# Altium schematic sheet WIFI.SchDoc
size A
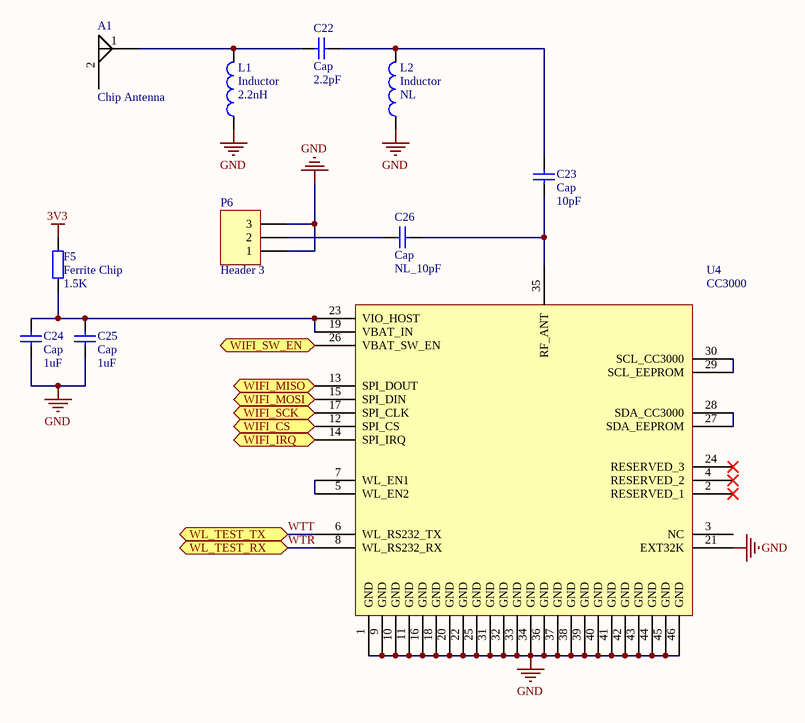
[diagram p0: WIFI.SchDoc]

## Parts
A1  Chip Antenna  [2500AT44M0400]
C22  Cap  value 2.2pF  [0402]
C23  Cap  value 10pF  [0402]
C24  Cap  value 1uF  [0603]
C25  Cap  value 1uF  [0603]
C26  Cap  value NL_10pF  [0402]
F5  Ferrite Chip  value 1.5K  [0603]
L1  Inductor  value 2.2nH  [0402]
L2  Inductor  value NL  [0402]
P6  Header 3  [U.FL-R-SMT-1]
U4  CC3000  [CC3000]

## Ports
WIFI_CS, WIFI_IRQ, WIFI_MISO, WIFI_MOSI, WIFI_SCK, WIFI_SW_EN, WL_TEST_RX, WL_TEST_TX

## Nets
3V3: F5.2
GND: C24.1 C25.1 L1.1 L2.1 P6.1 P6.3 U4.1(GND) U4.9(GND) U4.10(GND) U4.11(GND) U4.16(GND) U4.18(GND) U4.20(GND) U4.21(EXT32K) U4.22(GND) U4.25(GND) U4.31(GND) U4.32(GND) U4.33(GND) U4.34(GND) U4.36(GND) U4.37(GND) U4.38(GND) U4.39(GND) U4.40(GND) U4.41(GND) U4.42(GND) U4.43(GND) U4.44(GND) U4.45(GND) U4.46(GND)
WIFI_CS: U4.12(SPI_CS) ; port WIFI_CS
WIFI_IRQ: U4.14(SPI_IRQ) ; port WIFI_IRQ
WIFI_MISO: U4.13(SPI_DOUT) ; port WIFI_MISO
WIFI_MOSI: U4.15(SPI_DIN) ; port WIFI_MOSI
WIFI_SCK: U4.17(SPI_CLK) ; port WIFI_SCK
WIFI_SW_EN: U4.26(VBAT_SW_EN) ; port WIFI_SW_EN
WTR: U4.8(WL_RS232_RX) ; port WL_TEST_RX
WTT: U4.6(WL_RS232_TX) ; port WL_TEST_TX
NetA1_1: A1.1 C22.2 L1.2
NetC22_1: C22.1 C23.2 L2.2
NetC23_1: C23.1 C26.1 U4.35(RF_ANT)
NetC24_2: C24.2 C25.2 F5.1 U4.19(VBAT_IN) U4.23(VIO_HOST)
NetC26_2: C26.2 P6.2
NetU4_5: U4.5(WL_EN2) U4.7(WL_EN1)
NetU4_27: U4.27(SDA_EEPROM) U4.28(SDA_CC3000)
NetU4_29: U4.29(SCL_EEPROM) U4.30(SCL_CC3000)

Not connected (* = marked no-connect by the designer): A1 2; U4 2(RESERVED_1)* 3(NC) 4(RESERVED_2)* 24(RESERVED_3)*

## Library data of the parts
A1 = ANT-SMT-2: Supplier 1: Digi-Key; Supplier Part Number 1: 712-1403-1-ND
C22-C26 = Cap: Capacitor; Supplier 1: Digi-Key
  C22: Supplier Part Number 1: 490-5932-1-ND
  C23 C26: Supplier Part Number 1: 311-1014-1-ND
  C24 C25: Supplier Part Number 1: 587-1242-1-ND
F5 = Res2: Supplier 1: Digi-Key; Supplier Part Number 1: 490-5216-1-ND
P6 = Header 3: Header, 3-Pin; Supplier 1: Digi-Key
U4 = CC3000: CC3000 WLAN Module; Supplier 1: Digi-Key; Supplier Part Number 1: 296-35512-1-ND
L1 L2 = Inductor: Supplier Part Number 1: 712-1414-1-ND; Supplier 1: Digi-Key